# Altium schematic sheet 1_MCU.SchDoc
size A4; SheetNumber: 1; SheetTotal: 3
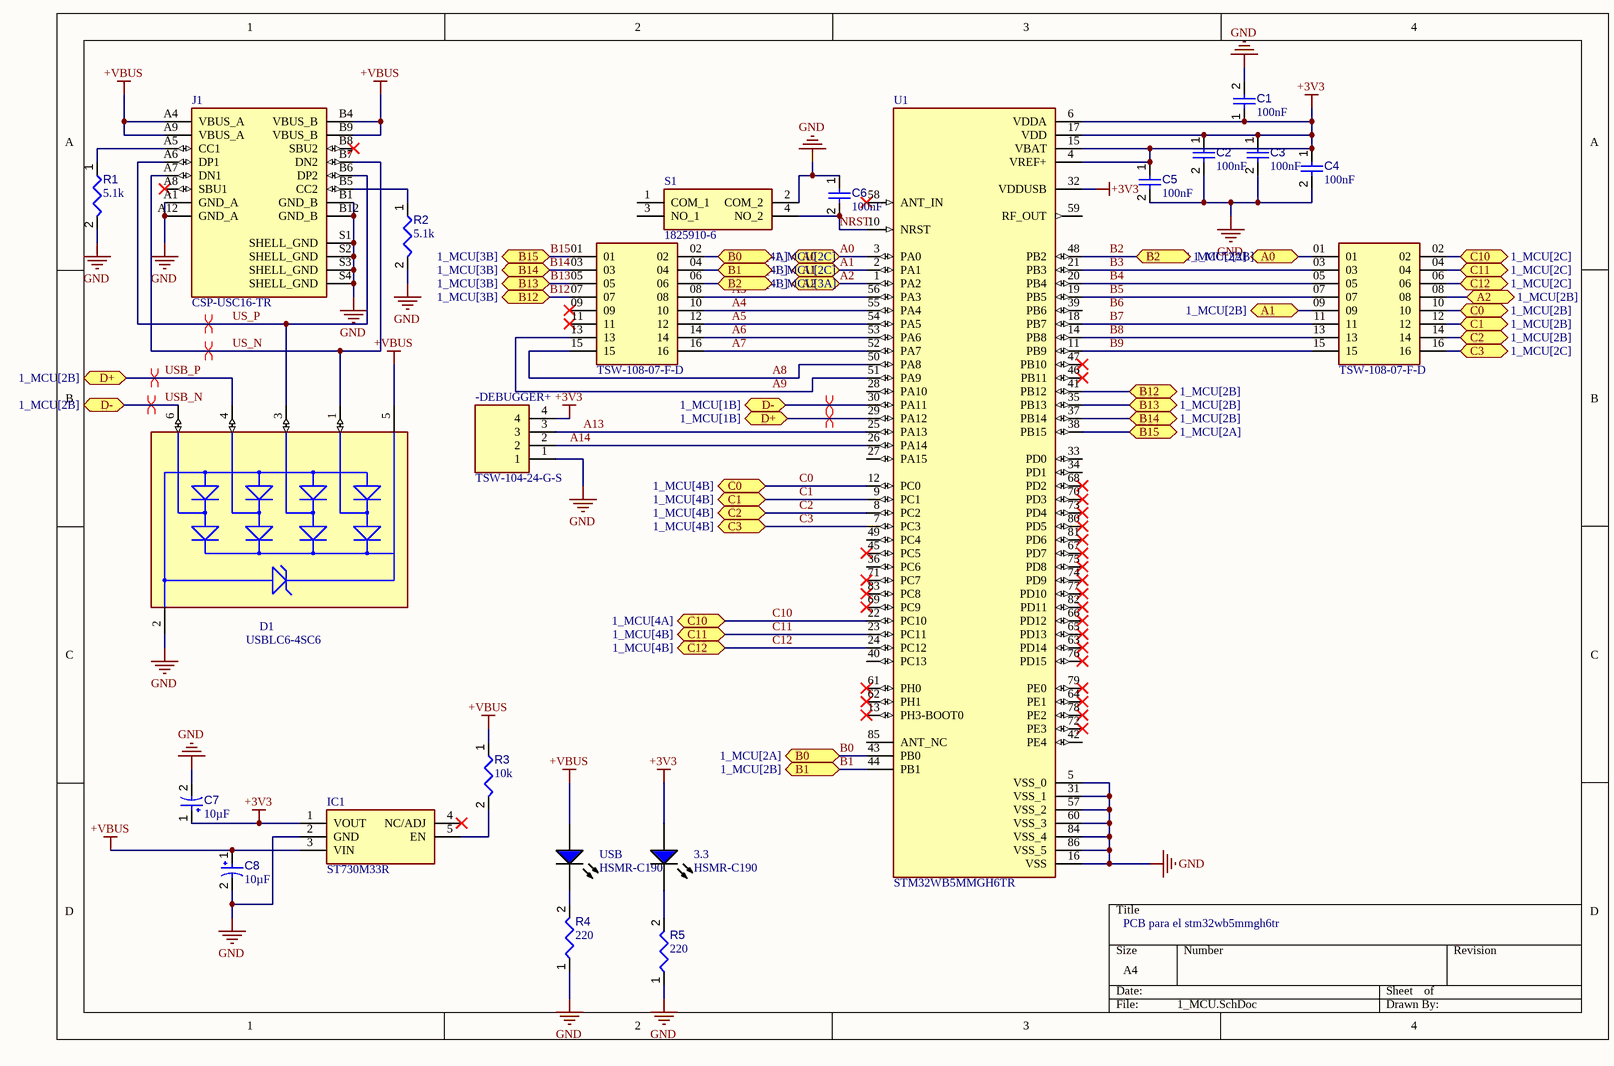
[diagram p0: 1_MCU.SchDoc]

## Parts
(Parts that share a designator on the sheet are numbered #1, #2 ... from top to bottom, then left to right.)
3.3  HSMR-C190  [AVAG-HSMX-C190_V]
-DEBUGGER+  TSW-104-24-G-S  [TSW-104-XX-YY-S]
?#1  TSW-108-07-F-D  [SAMTEC_TSW-108-07-F-D]
?#2  TSW-108-07-F-D  [SAMTEC_TSW-108-07-F-D]
C1  value 100nF  [CAPC1608X90X40NL10T20]  (hidden comment: Capacitor 100 nF +/-10% 50 V 0603)
C2  value 100nF  [CAPC1608X90X40NL10T20]  (hidden comment: Capacitor 100 nF +/-10% 50 V 0603)
C3  value 100nF  [CAPC1608X90X40NL10T20]  (hidden comment: Capacitor 100 nF +/-10% 50 V 0603)
C4  value 100nF  [CAPC1608X90X40NL10T20]  (hidden comment: Capacitor 100 nF +/-10% 50 V 0603)
C5  value 100nF  [CAPC1608X90X40NL10T20]  (hidden comment: Capacitor 100 nF +/-10% 50 V 0603)
C6  value 100nF  [CAPC1608X90X40NL10T20]  (hidden comment: Capacitor 100 nF +/-10% 50 V 0603)
C7  value 10µF  [CAPPR55-200-1100X500X1200]  (hidden comment: ECA1HM100)
C8  value 10µF  [CAPPR55-200-1100X500X1200]  (hidden comment: ECA1HM100)
D1  USBLC6-4SC6  [FP-SOT23-6L-MFG]
IC1  ST730M33R  [SOT95P280X145-5N]
J1  CSP-USC16-TR  [VALCON_CSP-USC16-TR]
R1  value 5.1k  [RESC1608X55X25ML10T15]  (hidden comment: Resistor 1k +/-1% 0603 100 5.1kmW)
R2  5.1k  [RESC1608X55X25ML10T15]
R3  10k  [RESC1608X55X25ML10T15]
R4  220  [RESC1608X55X25ML10T15]
R5  220  [RESC1608X55X25ML10T15]
S1  1825910-6  [18259106]
U1  STM32WB5MMGH6TR  [XCVR_STM32WB5MMGH6TR]
USB  HSMR-C190  [AVAG-HSMX-C190_V]

## Ports
A0 (bidir, see 1_MCU[2A]), A0 (bidir, see 1_MCU[4A]), A1 (bidir, see 1_MCU[2B]), A1 (bidir, see 1_MCU[4B]), A2 (bidir, see 1_MCU[2B]), A2 (bidir, see 1_MCU[4B]), B0 (bidir, see 1_MCU[2A]), B0 (bidir, see 1_MCU[2C]), B1 (bidir, see 1_MCU[2B]), B1 (bidir, see 1_MCU[2C]), B2 (bidir, see 1_MCU[2B]), B2 (bidir, see 1_MCU[3A]), B12 (bidir, see 1_MCU[2B]), B12 (bidir, see 1_MCU[3B]), B13 (bidir, see 1_MCU[2B]), B13 (bidir, see 1_MCU[3B]), B14 (bidir, see 1_MCU[2B]), B14 (bidir, see 1_MCU[3B]), B15 (bidir, see 1_MCU[2A]), B15 (bidir, see 1_MCU[3B]), C0 (bidir, see 1_MCU[2B]), C0 (bidir, see 1_MCU[4B]), C1 (bidir, see 1_MCU[2B]), C1 (bidir, see 1_MCU[4B]), C2 (bidir, see 1_MCU[2B]), C2 (bidir, see 1_MCU[4B]), C3 (bidir, see 1_MCU[2C]), C3 (bidir, see 1_MCU[4B]), C10 (bidir, see 1_MCU[2C]), C10 (bidir, see 1_MCU[4A]), C11 (bidir, see 1_MCU[2C]), C11 (bidir, see 1_MCU[4B]), C12 (bidir, see 1_MCU[2C]), C12 (bidir, see 1_MCU[4B]), D+ (bidir, see 1_MCU[1B]), D+ (bidir, see 1_MCU[2B]), D- (bidir, see 1_MCU[1B]), D- (bidir, see 1_MCU[2B])

## Nets
+3V3: 3.3.1(A) -DEBUGGER+.4 C1.1 C2.1 C3.1 C4.1 C5.1 C7.1 IC1.1(VOUT) U1.4(VREF+) U1.6(VDDA) U1.15(VBAT) U1.17(VDD) U1.32(VDDUSB)
+VBUS: C8.1 D1.5(VBUS) IC1.3(VIN) J1.A4(VBUS_A) J1.A9(VBUS_A) J1.B4(VBUS_B) J1.B9(VBUS_B) R3.1 USB.1(A)
GND: -DEBUGGER+.1 C1.2 C2.2 C3.2 C4.2 C5.2 C6.1 C7.2 C8.2 D1.2(GND) IC1.2(GND) J1.A1(GND_A) J1.A12(GND_A) J1.B1(GND_B) J1.B12(GND_B) J1.S1(SHELL_GND) J1.S2(SHELL_GND) J1.S3(SHELL_GND) J1.S4(SHELL_GND) R1.2 R2.2 R4.1 R5.1 S1.2(COM_2) U1.5(VSS_0) U1.16(VSS) U1.31(VSS_1) U1.57(VSS_2) U1.60(VSS_3) U1.84(VSS_4) U1.86(VSS_5)
A0: ?#2.01 U1.3(PA0) ; port A0
A1: ?#2.09 U1.2(PA1) ; port A1
A2: ?#2.08 U1.1(PA2) ; port A2
A3: ?#1.08 U1.56(PA3)
A4: ?#1.10 U1.55(PA4)
A5: ?#1.12 U1.54(PA5)
A6: ?#1.14 U1.53(PA6)
A7: ?#1.16 U1.52(PA7)
A8: ?#1.15 U1.50(PA8)
A9: ?#1.13 U1.51(PA9)
A13: -DEBUGGER+.3 U1.25(PA13)
A14: -DEBUGGER+.2 U1.26(PA14)
B0: ?#1.02 U1.43(PB0) ; port B0
B1: ?#1.04 U1.44(PB1) ; port B1
B2: ?#1.06 U1.48(PB2) ; port B2
B3: ?#2.03 U1.21(PB3)
B4: ?#2.05 U1.20(PB4)
B5: ?#2.07 U1.19(PB5)
B7: ?#2.11 U1.18(PB7)
B8: ?#2.13 U1.14(PB8)
B9: ?#2.15 U1.11(PB9)
B12: ?#1.07 U1.41(PB12) ; port B12
B13: ?#1.05 U1.35(PB13) ; port B13
B14: ?#1.03 U1.37(PB14) ; port B14
B15: ?#1.01 U1.38(PB15) ; port B15
C0: ?#2.10 U1.12(PC0) ; port C0
C1: ?#2.12 U1.9(PC1) ; port C1
C2: ?#2.14 U1.8(PC2) ; port C2
C3: ?#2.16 U1.7(PC3) ; port C3
C10: ?#2.02 U1.22(PC10) ; port C10
C11: ?#2.04 U1.23(PC11) ; port C11
C12: ?#2.06 U1.24(PC12) ; port C12
NRST: C6.2 S1.4(NO_2) U1.10(NRST)
US_N: D1.1(I/O1) J1.A7(DN1) J1.B7(DN2)
US_P: D1.3(I/O2) J1.A6(DP1) J1.B6(DP2)
USB_N: D1.6(I/O4) U1.30(PA11) ; port D-
USB_P: D1.4(I/O3) U1.29(PA12) ; port D+
Net3.3_2: 3.3.2(K) R5.2
NetIC1_5: IC1.5(EN) R3.2
NetJ1_A5: J1.A5(CC1) R1.1
NetJ1_B5: J1.B5(CC2) R2.1
NetR4_2: R4.2 USB.2(K)

Not connected (* = marked no-connect by the designer): ?#1 09* 11*; IC1 4(NC/ADJ)*; J1 A8(SBU1)* B8(SBU2)*; S1 1(COM_1) 3(NO_1); U1 13(PH3-BOOT0)* 27(PA15) 28(PA10) 33(PD0) 34(PD1) 36(PC6) 39(PB6) 40(PC13) 42(PE4) 45(PC5)* 46(PB11)* 47(PB10)* 49(PC4) 58(ANT_IN)* 59(RF_OUT) 61(PH0)* 62(PH1)* 63(PD14)* 64(PE1)* 65(PD13)* 66(PD12)* 67(PD7)* 68(PD2)* 69(PC9)* 70(PD3)* 71(PC7)* 72(PE3)* 73(PD4)* 74(PD9)* 75(PD8)* 76(PD15)* 77(PD10)* 78(PE2)* 79(PE0)* 80(PD5)* 81(PD6)* 82(PD11)* 83(PC8)* 85(ANT_NC)

## Layout directives
differential pair; differential pair class USB: US_N, US_P
differential pair: USB_N, USB_P

## Notes on the sheet
- PCB para el stm32wb5mmgh6tr
- Labels drawn without touching a wire or pin: B6

## Library data of the parts
3.3 USB = CMP-007-00015-2: LED Uni-Color Blue, 78 mW, 20 mA, -40 to 85 degC, 2-Pin SMD, RoHS, Tape and Reel; Manufacturer: Avago; Forward Voltage: 3.4V; Power: 78mW; Forward Current: 20mA; Luminous Intensity: 55mcd; Lens Style: Diffused; Viewing Angle: 155degrees; Pins: 2; Max Operating Temperature: 85°C; Colour: Blue; Datasheet Version: Apr-10; RoHS Compliant: True; Mounting Technology: SM; Min Operating Temperature: -40°C; Illumination Colour: Blue; Package Quantity: 4000; Datasheet URL: http://docs.avagotech.com/docs/AV02-0977EN; Package Reference: HSMX-C190; Packaging: TapeandReel; Nominal Vf: 3.4V; Case/Package: 0603; Package Description: 2-Pin Surface Mount Device, Body 1.6 x 0.8 mm, Height 0.9 mm; Manufacturer URL: http://www.avagotech.com/
-DEBUGGER+ = TSW-104-24-G-S: Connector; Manufacturer_Name: SAMTEC; Datasheet Link: http://suddendocs.samtec.com/prints/tsw-xxx-xx-xxx-x-xx-xxx-mkt.pdf; Manufacturer_Part_Number: TSW-104-24-G-S; Mouser Part Number: 200-TSW10424GS; Mouser Price/Stock: https://www.mouser.co.uk/ProductDetail/Samtec/TSW-104-24-G-S?qs=rU5fayqh%252BE0UmrmG73qvDg%3D%3D; Arrow Part Number: TSW-104-24-G-S; Arrow Price/Stock: https://www.arrow.com/en/products/tsw-104-24-g-s/samtec?region=europe
?#1 ?#2 = CMP-002-00072-1: MF: Samtec; Availability: Unavailable; Component Type: Standard; Value: *; Case/Package: None; Design Item ID: TSW-108-07-F-D; Pins: 16; Source: TSW-108-07-F-D.SchLib; Price: None; MP: TSW-108-07-F-D
C1-C6 = CMP-001-00017-6: Chip Capacitor, 100 nF, +/- 10%, 50 V, 0603 (1608 Metric); Voltage Rating: 50V; Capacitor Type: Ceramic; Tolerance: 10%; Mounting Technology: SM; Max Operating Temperature: 125°C; RoHS Compliant: True; Pins: 2; Case/Package: 0603; Min Operating Temperature: -55°C
C7 C8 = CMP-001-00025-7: Aluminum Electrolytic Capacitor, 10 uF, +/- 20%, 50 V, -40 to 85 degC, 2-Pin THD, RoHS, Bulk; Manufacturer: Panasonic; Ripple Current (AC): 65mA; Voltage Rating: 50V; Mounting Technology: TH; RoHS Compliant: True; Capacitor Type: Electrolytic; Datasheet Version: Rev. 05, 10/2016; Min Operating Temperature: -40°C; Packaging: Bulk; Ripple Current: 65mA; Tolerance: 20%; Max Operating Temperature: 85°C; Datasheet URL: https://industrial.panasonic.com/cdbs/www-data/pdf/RDF0000/ABA0000C1218.pdf; Lead Pitch: 2mm; Pins: 2; Diameter: 5mm; Manufacturer URL: http://www.panasonic.com/; Package Reference: CAPPR55-200-1100X500X1200; Package Description: 2-Pin Radial Lead, Dia 5 mm, Height 12 mm; Case/Package: Radial; Package Quantity: 200
D1 = CMP-2000-07370-2: TVS DIODE 5.25V 17V SOT23-6; Manufacturer: STMicroelectronics; Peak Pulse Power: 130W; Breakdown Voltage: 6V; Value: 3pF; Direction: Unidirectional; Interface: USB,Ethernet,Other; Number Of Channels: 4; Standoff Height: 0mm; Max Junction Temp: +125°C; Digikey Description: TVS DIODE 5.25V 17V SOT23-6; Automotive: No; Package: SOT23-6L; Mouser Description: USBLC6 Series 4 Line 6 V Uni / Bi-Directional ESD Protection - SOT-23-6; Octopart: https://octopart.com/usblc6-4sc6-stmicroelectronics-347147; RoHS: TRUE; ComponentLink2URL: https://upverter.com/datasheet/23dc4ffb028d868909e80577610284b194f13213.pdf; ComponentLink2Description: Datasheet; Device Class L1: Circuit Protection; Lead Free: Yes; Temperature Range High: +125°C; Device Class L2: ESD and Circuit Protection ICs; Device Class L3: unset; Capacitance: 3pF; Height: 1.45mm; Temperature Range Low: -40°C; Manufacturer Part Number: USBLC6-4SC6; Temperature: -40°C to +125°C; Category: Diode; Clamping Voltage: 17V
IC1 = ST730M33R: Integrated Circuit; Manufacturer_Name: STMicroelectronics; Datasheet Link: https://www.mouser.at/datasheet/2/389/st730-1621297.pdf; Height: 1.45mm; Manufacturer_Part_Number: ST730M33R; Mouser Part Number: 511-ST730M33R; Mouser Price/Stock: https://www.mouser.co.uk/ProductDetail/STMicroelectronics/ST730M33R?qs=GedFDFLaBXHUqSNzaYM2bg%3D%3D; Arrow Part Number: ST730M33R; Arrow Price/Stock: https://www.arrow.com/en/products/st730m33r/stmicroelectronics?region=nac
J1 = CMP-002-00071-1: CSP-USC16-TR Valcon USB Type C Surface Mount PCB Socket; Design Item ID: CSP-USC16-TR; Value: *; Source: CSP-USC16-TR.SchLib; Availability: In Stock; Pins: 20; Case/Package: None; Price: None; MF: Valcon; Component Type: Standard; Check_prices: https://www.snapeda.com/parts/CSP-USC16-TR/Valcon/view-part/?ref=eda; SnapEDA_Link: https://www.snapeda.com/parts/CSP-USC16-TR/Valcon/view-part/?ref=snap; Purchase-URL: https://pricing.snapeda.com/search/part/CSP-USC16-TR/?ref=eda; MP: CSP-USC16-TR
R1 R2 = CMP-009-00014-5: Chip Resistor, 1 KOhm, +/-1%, 0.1 W, -55 to 155 degC, 0603 (1608 Metric); Voltage Rating: 50V; Power: 100mW; Tolerance: 1%; Mounting Technology: SM; Pins: 2; Case/Package: 0603; Min Operating Temperature: -55°C; RoHS Compliant: True; Max Operating Temperature: 155°C
  R2: Value: 5.1k
R3-R5 = CMP-009-00017-5: Chip Resistor, 10 KOhm, +/- 1%, 01 W, -55 to 155 degC, 0603 (1608 Metric); Voltage Rating: 50V; Power: 100mW; RoHS Compliant: True; Min Operating Temperature: -55°C; Pins: 2; Case/Package: 0603; Mounting Technology: SM; Max Operating Temperature: 155°C; Tolerance: 1%
  R3: Value: 10k
  R4 R5: Value: 220
S1 = 1825910-6: Switch; Manufacturer_Name: TE Connectivity; Datasheet Link: https://www.te.com/commerce/DocumentDelivery/DDEController?Action=srchrtrv&DocNm=1825910&DocType=Customer+Drawing&DocLang=English&DocFormat=pdf&PartCntxt=1825910-6; Height: 5.3mm; Manufacturer_Part_Number: 1825910-6; Mouser Part Number: N/A; Mouser Price/Stock: https://www.mouser.co.uk/ProductDetail/TE-Connectivity/1825910-6?qs=A6cQTCBcXncisYDS1KbpGA%3D%3D; Arrow Part Number: 1825910-6; Arrow Price/Stock: https://www.arrow.com/en/products/1825910-6/te-connectivity?region=europe
U1 = CMP-003-000000-1: 802.15.4ï¼Œ è“ç‰™è“ç‰™ v5.0ï¼Œ çº¿ç¨‹ï¼Œ ZigbeeÂ® æ”¶å‘æ¨¡å— 2.4GHz é›†æˆï¼Œ èŠ¯ç‰‡è¡¨é¢è´´è£…; MF: STMicroelectronics; Pin Count: 86; Check_prices: https://www.snapeda.com/parts/STM32WB5MMGH6TR/STMicroelectronics/view-part/?ref=eda; Design Item ID: STM32WB5MMGH6TR; Availability: In Stock; Value: *; SnapEDA_Link: https://www.snapeda.com/parts/STM32WB5MMGH6TR/STMicroelectronics/view-part/?ref=snap; Purchase-URL: https://pricing.snapeda.com/search/part/STM32WB5MMGH6TR/?ref=eda; Price: None; MP: STM32WB5MMGH6TR; Source: STM32WB5MMGH6TR.SchLib; Package: LFLGA-86 STMicroelectronics; Component Type: Standard